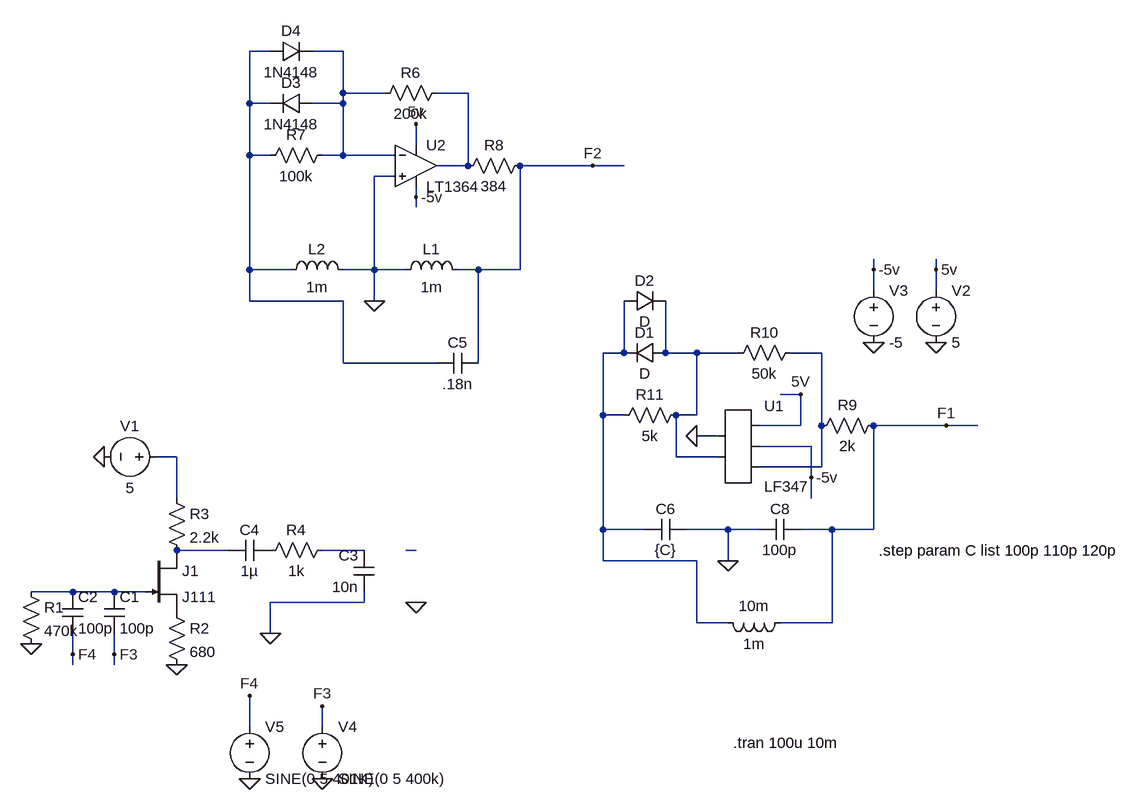
[diagram p0: schematic draft1.asc]
draft1.asc, the LTspice schematic file:
Version 4
SHEET 1 3148 9824
WIRE 752 -400 720 -400
WIRE 864 -400 816 -400
WIRE 864 -336 864 -400
WIRE 928 -336 864 -336
WIRE 1056 -336 1008 -336
WIRE 720 -320 720 -400
WIRE 752 -320 720 -320
WIRE 864 -320 864 -336
WIRE 864 -320 816 -320
WIRE 976 -256 976 -288
WIRE 720 -240 720 -320
WIRE 752 -240 720 -240
WIRE 864 -240 864 -320
WIRE 864 -240 832 -240
WIRE 944 -240 864 -240
WIRE 1056 -224 1056 -336
WIRE 1056 -224 1008 -224
WIRE 1248 -224 1136 -224
WIRE 1296 -224 1248 -224
WIRE 944 -208 912 -208
WIRE 976 -176 976 -192
WIRE 976 -160 976 -176
WIRE 720 -64 720 -240
WIRE 784 -64 720 -64
WIRE 912 -64 912 -208
WIRE 912 -64 864 -64
WIRE 960 -64 912 -64
WIRE 1072 -64 1040 -64
WIRE 1136 -64 1136 -224
WIRE 1136 -64 1072 -64
WIRE 1680 -64 1680 -80
WIRE 1776 -64 1776 -80
WIRE 1680 -32 1680 -64
WIRE 1776 -32 1776 -64
WIRE 720 -16 720 -64
WIRE 864 -16 720 -16
WIRE 912 -16 912 -64
WIRE 1296 64 1296 -16
WIRE 1296 64 1264 64
WIRE 1360 64 1360 -16
WIRE 1408 64 1360 64
WIRE 1472 64 1408 64
WIRE 1600 64 1552 64
WIRE 864 80 864 -16
WIRE 1008 80 864 80
WIRE 1072 80 1072 -64
WIRE 1568 128 1536 128
WIRE 1264 160 1264 64
WIRE 1296 160 1264 160
WIRE 1408 160 1408 64
WIRE 1408 160 1376 160
WIRE 1568 176 1568 128
WIRE 1568 176 1504 176
WIRE 1600 176 1600 64
WIRE 1792 176 1680 176
WIRE 1840 176 1792 176
WIRE 1440 192 1408 192
WIRE 1584 208 1504 208
WIRE 608 224 576 224
WIRE 1376 224 1376 160
WIRE 1440 224 1376 224
WIRE 1600 240 1600 176
WIRE 1600 240 1504 240
WIRE 1584 256 1584 208
WIRE 608 288 608 224
WIRE 1584 288 1584 256
WIRE 1264 336 1264 160
WIRE 1328 336 1264 336
WIRE 1456 336 1392 336
WIRE 1504 336 1456 336
WIRE 1616 336 1568 336
WIRE 1680 336 1680 176
WIRE 1680 336 1616 336
WIRE 688 368 608 368
WIRE 896 368 832 368
WIRE 976 368 960 368
WIRE 1264 384 1264 336
WIRE 1408 384 1264 384
WIRE 1456 384 1456 336
WIRE 448 432 384 432
WIRE 512 432 448 432
WIRE 560 432 512 432
WIRE 896 448 896 432
WIRE 896 448 752 448
WIRE 1408 480 1408 384
WIRE 1456 480 1408 480
WIRE 1616 480 1616 336
WIRE 1616 480 1536 480
WIRE 752 496 752 448
WIRE 448 528 448 496
WIRE 512 528 512 496
WIRE 448 544 448 528
WIRE 512 544 512 528
WIRE 720 640 720 592
WIRE 832 640 832 608
FLAG 384 512 0
FLAG 608 544 0
FLAG 496 224 0
FLAG 512 528 F3
FLAG 752 496 0
FLAG 976 448 0
FLAG 1776 48 0
FLAG 1776 -64 5v
FLAG 1680 48 0
FLAG 1680 -64 -5v
FLAG 1456 384 0
FLAG 1792 176 F1
FLAG 976 -288 5v
FLAG 912 -16 0
FLAG 976 -176 -5v
FLAG 1248 -224 F2
FLAG 832 720 0
FLAG 832 608 F3
FLAG 448 528 F4
FLAG 1584 256 -5v
FLAG 1568 128 5V
FLAG 720 720 0
FLAG 720 592 F4
FLAG 1408 192 0
SYMBOL njf 560 368 R0
SYMATTR InstName J1
SYMATTR Value J111
SYMBOL Cap 496 432 R0
SYMATTR InstName C1
SYMATTR Value 100p
SYMBOL Cap 432 432 R0
SYMATTR InstName C2
SYMATTR Value 100p
SYMBOL Res 368 416 R0
SYMATTR InstName R1
SYMATTR Value 470k
SYMBOL Res 592 448 R0
SYMATTR InstName R2
SYMATTR Value 680
SYMBOL Res 592 272 R0
SYMATTR InstName R3
SYMATTR Value 2.2k
SYMBOL Voltage 592 224 R90
WINDOW 0 -32 56 VBottom 2
WINDOW 3 32 56 VTop 2
SYMATTR InstName V1
SYMATTR Value 5
SYMBOL Res 848 352 R90
WINDOW 0 0 56 VBottom 2
WINDOW 3 32 56 VTop 2
SYMATTR InstName R4
SYMATTR Value 1k
SYMBOL Cap 912 432 R180
WINDOW 0 24 56 Left 2
WINDOW 3 24 8 Left 2
SYMATTR InstName C3
SYMATTR Value 10n
SYMBOL Cap 752 352 R90
WINDOW 0 0 32 VBottom 2
WINDOW 3 32 32 VTop 2
SYMATTR InstName C4
SYMATTR Value 1µ
SYMBOL Voltage 1776 -48 R0
SYMATTR InstName V2
SYMATTR Value 5
SYMBOL Voltage 1680 -48 R0
SYMATTR InstName V3
SYMATTR Value -5
SYMBOL Res 1568 48 R90
WINDOW 0 0 56 VBottom 2
WINDOW 3 32 56 VTop 2
SYMATTR InstName R10
SYMATTR Value 50k
SYMBOL Res 1392 144 R90
WINDOW 0 0 56 VBottom 2
WINDOW 3 32 56 VTop 2
SYMATTR InstName R11
SYMATTR Value 5k
SYMBOL Res 1024 -352 R90
WINDOW 0 0 56 VBottom 2
WINDOW 3 32 56 VTop 2
SYMATTR InstName R6
SYMATTR Value 200k
SYMBOL Res 848 -256 R90
WINDOW 0 0 56 VBottom 2
WINDOW 3 32 56 VTop 2
SYMATTR InstName R7
SYMATTR Value 100k
SYMBOL OpAmps/LT1364 976 -288 R0
SYMATTR InstName U2
SYMBOL ind 944 -48 R270
WINDOW 0 32 56 VTop 2
WINDOW 3 5 56 VBottom 2
SYMATTR InstName L1
SYMATTR Value 1m
SYMBOL ind 768 -48 R270
WINDOW 0 32 56 VTop 2
WINDOW 3 5 56 VBottom 2
SYMATTR InstName L2
SYMATTR Value 1m
SYMBOL diode 816 -336 R90
WINDOW 0 0 32 VBottom 2
WINDOW 3 32 32 VTop 2
SYMATTR InstName D3
SYMATTR Value 1N4148
SYMBOL diode 752 -384 R270
WINDOW 0 32 32 VTop 2
WINDOW 3 0 32 VBottom 2
SYMATTR InstName D4
SYMATTR Value 1N4148
SYMBOL Cap 1072 64 R90
WINDOW 0 0 32 VBottom 2
WINDOW 3 32 32 VTop 2
SYMATTR InstName C5
SYMATTR Value .18n
SYMBOL Res 1152 -240 R90
WINDOW 0 0 56 VBottom 2
WINDOW 3 32 56 VTop 2
SYMATTR InstName R8
SYMATTR Value 384
SYMBOL Voltage 832 624 R0
SYMATTR InstName V4
SYMATTR Value SINE(0 5 400k)
SYMBOL AutoGenerated/LF347 1472 208 R0
SYMATTR InstName U1
SYMBOL ind 1552 464 R90
WINDOW 0 5 56 VBottom 2
WINDOW 3 32 56 VTop 2
SYMATTR InstName 10m
SYMATTR Value 1m
SYMBOL Cap 1392 320 R90
WINDOW 0 0 32 VBottom 2
WINDOW 3 32 32 VTop 2
SYMATTR InstName C6
SYMATTR Value {C}
SYMBOL Cap 1568 320 R90
WINDOW 0 0 32 VBottom 2
WINDOW 3 32 32 VTop 2
SYMATTR InstName C8
SYMATTR Value 100p
SYMBOL Voltage 720 624 R0
SYMATTR InstName V5
SYMATTR Value SINE(0 5 401K)
SYMBOL Res 1696 160 R90
WINDOW 0 0 56 VBottom 2
WINDOW 3 32 56 VTop 2
SYMATTR InstName R9
SYMATTR Value 2k
SYMBOL Diode 1360 48 R90
WINDOW 0 0 32 VBottom 2
WINDOW 3 32 32 VTop 2
SYMATTR InstName D1
SYMBOL Diode 1296 0 R270
WINDOW 0 32 32 VTop 2
WINDOW 3 0 32 VBottom 2
SYMATTR InstName D2
TEXT 1464 664 Left 2 !.tran 100u 10m
TEXT 1688 368 Left 2 !.step param C list 100p 110p 120p

The netlist it stands for:
* draft1.asc
J1 N008 N011 P001 J111
C1 N011 F3 100p
C2 N011 F4 100p
R1 N011 0 470k
R2 P001 0 680
R3 N007 N008 2.2k
V1 N007 0 5
R4 N009 P002 1k
C3 0 N009 10n
C4 P002 N008 1µ
V2 5v 0 5
V3 -5v 0 -5
R10 N006 N005 50k
R11 N005 N004 5k
R6 N003 N002 200k
R7 N002 N001 100k
XU2 0 N002 5v -5v N003 LT1363  ; LT1364, pins In+ In- V+ V- OUT
L1 0 F2 1m
L2 N001 0 1m
D3 N002 N001 1N4148
D4 N001 N002 1N4148
C5 F2 N001 .18n
R8 F2 N003 384
V4 F3 0 SINE(0 5 400k)
* U1: LF347 (symbol AutoGenerated/LF347 not available, pins judged from their places): pin1=0 pin2=N005 pin3=5v pin4=-5v pin5=N006
L§10m F1 N004 1m
C6 0 N004 {C}
C8 F1 0 100p
V5 F4 0 SINE(0 5 401K)
R9 F1 N006 2k
D1 N005 N004 D
D2 N004 N005 D
.model D D
.lib standard.dio
.model NJF NJF
.model PJF PJF
.lib standard.jft
.tran 100u 10m
.step param C list 100p 110p 120p
.lib LTC.lib
.backanno
.end